# Altium schematic sheet Connectors.SchDoc
size A4; SheetNumber: 1; SheetTotal: 1
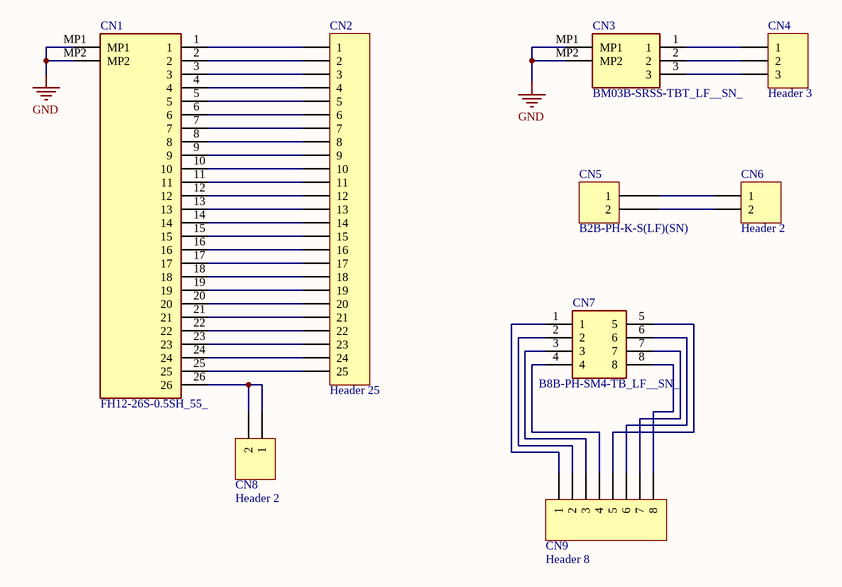
[diagram p0: Connectors.SchDoc]

## Parts
CN1  FH12-26S-0.5SH_55_  [FH1226S05SH55]
CN2  Header 25  [HDR1X25]
CN3  BM03B-SRSS-TBT_LF__SN_  [BM03BSRSSTBTLFSN]
CN4  Header 3  [HDR1X3]
CN5  B2B-PH-K-S(LF)(SN)  [JST B2B-PH-K]
CN6  Header 2  [HDR1X2]
CN7  B8B-PH-SM4-TB_LF__SN_  [B8B-PH-SM4-TB]
CN8  Header 2  [HDR1X2]
CN9  Header 8  [HDR1X8]

## Nets
GND: CN1.MP1 CN1.MP2 CN3.MP1 CN3.MP2
NetCN1_1: CN1.1 CN2.1
NetCN1_2: CN1.2 CN2.2
NetCN1_3: CN1.3 CN2.3
NetCN1_4: CN1.4 CN2.4
NetCN1_5: CN1.5 CN2.5
NetCN1_6: CN1.6 CN2.6
NetCN1_7: CN1.7 CN2.7
NetCN1_8: CN1.8 CN2.8
NetCN1_9: CN1.9 CN2.9
NetCN1_10: CN1.10 CN2.10
NetCN1_11: CN1.11 CN2.11
NetCN1_12: CN1.12 CN2.12
NetCN1_13: CN1.13 CN2.13
NetCN1_14: CN1.14 CN2.14
NetCN1_15: CN1.15 CN2.15
NetCN1_16: CN1.16 CN2.16
NetCN1_17: CN1.17 CN2.17
NetCN1_18: CN1.18 CN2.18
NetCN1_19: CN1.19 CN2.19
NetCN1_20: CN1.20 CN2.20
NetCN1_21: CN1.21 CN2.21
NetCN1_22: CN1.22 CN2.22
NetCN1_23: CN1.23 CN2.23
NetCN1_24: CN1.24 CN2.24
NetCN1_25: CN1.25 CN2.25
NetCN1_26: CN1.26 CN8.1 CN8.2
NetCN3_1: CN3.1 CN4.1
NetCN3_2: CN3.2 CN4.2
NetCN3_3: CN3.3 CN4.3
NetCN5_1: CN5.1 CN6.1
NetCN5_2: CN5.2 CN6.2
NetCN7_1: CN7.1 CN9.1
NetCN7_2: CN7.2 CN9.2
NetCN7_3: CN7.3 CN9.3
NetCN7_4: CN7.4 CN9.4
NetCN7_5: CN7.5 CN9.5
NetCN7_6: CN7.6 CN9.6
NetCN7_7: CN7.7 CN9.7
NetCN7_8: CN7.8 CN9.8

## Library data of the parts
CN1 = FH12-26S-0.5SH_55_: Connector; Manufacturer_Name: Hirose; Manufacturer_Part_Number: FH12-26S-0.5SH(55); Datasheet Link: https://datasheet.datasheetarchive.com/originals/distributors/SFDatasheet-1/sf-00023459.pdf; Height: 2.2mm; Mouser Part Number: 798-FH12-26S-0.5SH55; Mouser Price/Stock: https://www.mouser.co.uk/ProductDetail/Hirose-Connector/FH12-26S-0.5SH55?qs=Ux3WWAnHpjC%2FipJJsmJDaQ%3D%3D; Arrow Part Number: FH12-26S-0.5SH(55); Arrow Price/Stock: https://www.arrow.com/en/products/fh12-26s-0.5sh-55/hirose-electric
CN2 = Header 25: Header, 25-Pin; LatestRevisionDate: 17-Jul-2002; LatestRevisionNote: Re-released for DXP Platform.; Publisher: Altium Limited
CN3 = BM03B-SRSS-TBT_LF__SN_: Connector; Manufacturer_Name: JST (JAPAN SOLDERLESS TERMINALS); Manufacturer_Part_Number: BM03B-SRSS-TBT(LF)(SN); Datasheet Link: http://www.jst-mfg.com/product/pdf/eng/eSR.pdf; Height: 4.25mm; Arrow Part Number: BM03B-SRSS-TBT(LF)(SN); Arrow Price/Stock: https://www.arrow.com/en/products/bm03b-srss-tbt-lf-sn/jst-manufacturing
CN4 = Header 3: Header, 3-Pin; LatestRevisionDate: 17-Jul-2002; LatestRevisionNote: Re-released for DXP Platform.; Publisher: Altium Limited
CN5 = B2B-PH-K-S(LF)(SN): CONN HEADER VERT 2POS 2MM; Manufacturer: JST Sales America Inc.; Contact Length - Mating: 0.130" (3.30mm); Contact Length - Post: 0.134" (3.40mm); Current Rating (Amps): 2A; Material Flammability Rating: UL94 V-0; Number of Positions: 2; Number of Positions Loaded: All; Overall Contact Length: 0.333" (8.45mm); Pitch - Mating: 0.079" (2.00mm); Shrouding: Shrouded - 4 Wall; Style: Board to Cable/Wire; Voltage Rating: 100V; Part Number: B2B-PH-K-S(LF)(SN); ComponentLink1Description: Datasheet; ComponentLink1URL: http://www.jst-mfg.com/product/pdf/eng/ePH.pdf; ComponentLink2Description: DigiKey Link; ComponentLink2URL: http://digikey.com/product-detail/en/jst-sales-america-inc/B2B-PH-K-S-LF-SN/455-1704-ND/926611; Connector Type: Header; Contact Finish - Mating: Tin; Contact Finish - Post: Tin; Contact Material: Brass; Contact Shape: Square; Contact Type: Male Pin; Fastening Type: Detent Lock; Insulation Color: Natural; Insulation Height: 0.236" (6.00mm); Insulation Material: Polyamide (PA66), Nylon 6/6; LastUpdated: 1/3/2020 11:40:58 PM; Lifecycle Status: Active; Minimum Order: 1; Mounting Type: Through Hole; Number of Rows: 1; Operating Temperature: -25°C ~ 85°C; Packaging: Bulk; PartId: 11; Part Status: Active; Price: 0.17; Series: PH; Supplier 1: DigiKey; Supplier Part Number 1: 455-1704-ND; Termination: Press-Fit, Solder
CN6 CN8 = Header 2: Header, 2-Pin; LatestRevisionDate: 17-Jul-2002; LatestRevisionNote: Re-released for DXP Platform.; Publisher: Altium Limited
CN7 = B8B-PH-SM4-TB_LF__SN_: Connector; Manufacturer_Name: JST (JAPAN SOLDERLESS TERMINALS); Manufacturer_Part_Number: B8B-PH-SM4-TB(LF)(SN); Datasheet Link: http://uk.rs-online.com/web/p/products/6881347; Arrow Part Number: B8B-PH-SM4-TB(LF)(SN); Arrow Price/Stock: https://www.arrow.com/en/products/b8b-ph-sm4-tb-lf-sn/jst-manufacturing?region=europe
CN9 = Header 8: Header, 8-Pin; LatestRevisionDate: 17-Jul-2002; LatestRevisionNote: Re-released for DXP Platform.; Publisher: Altium Limited